# EAGLE design riffle-CT-mcv-0.1.0 (EAGLE 7.3.0)
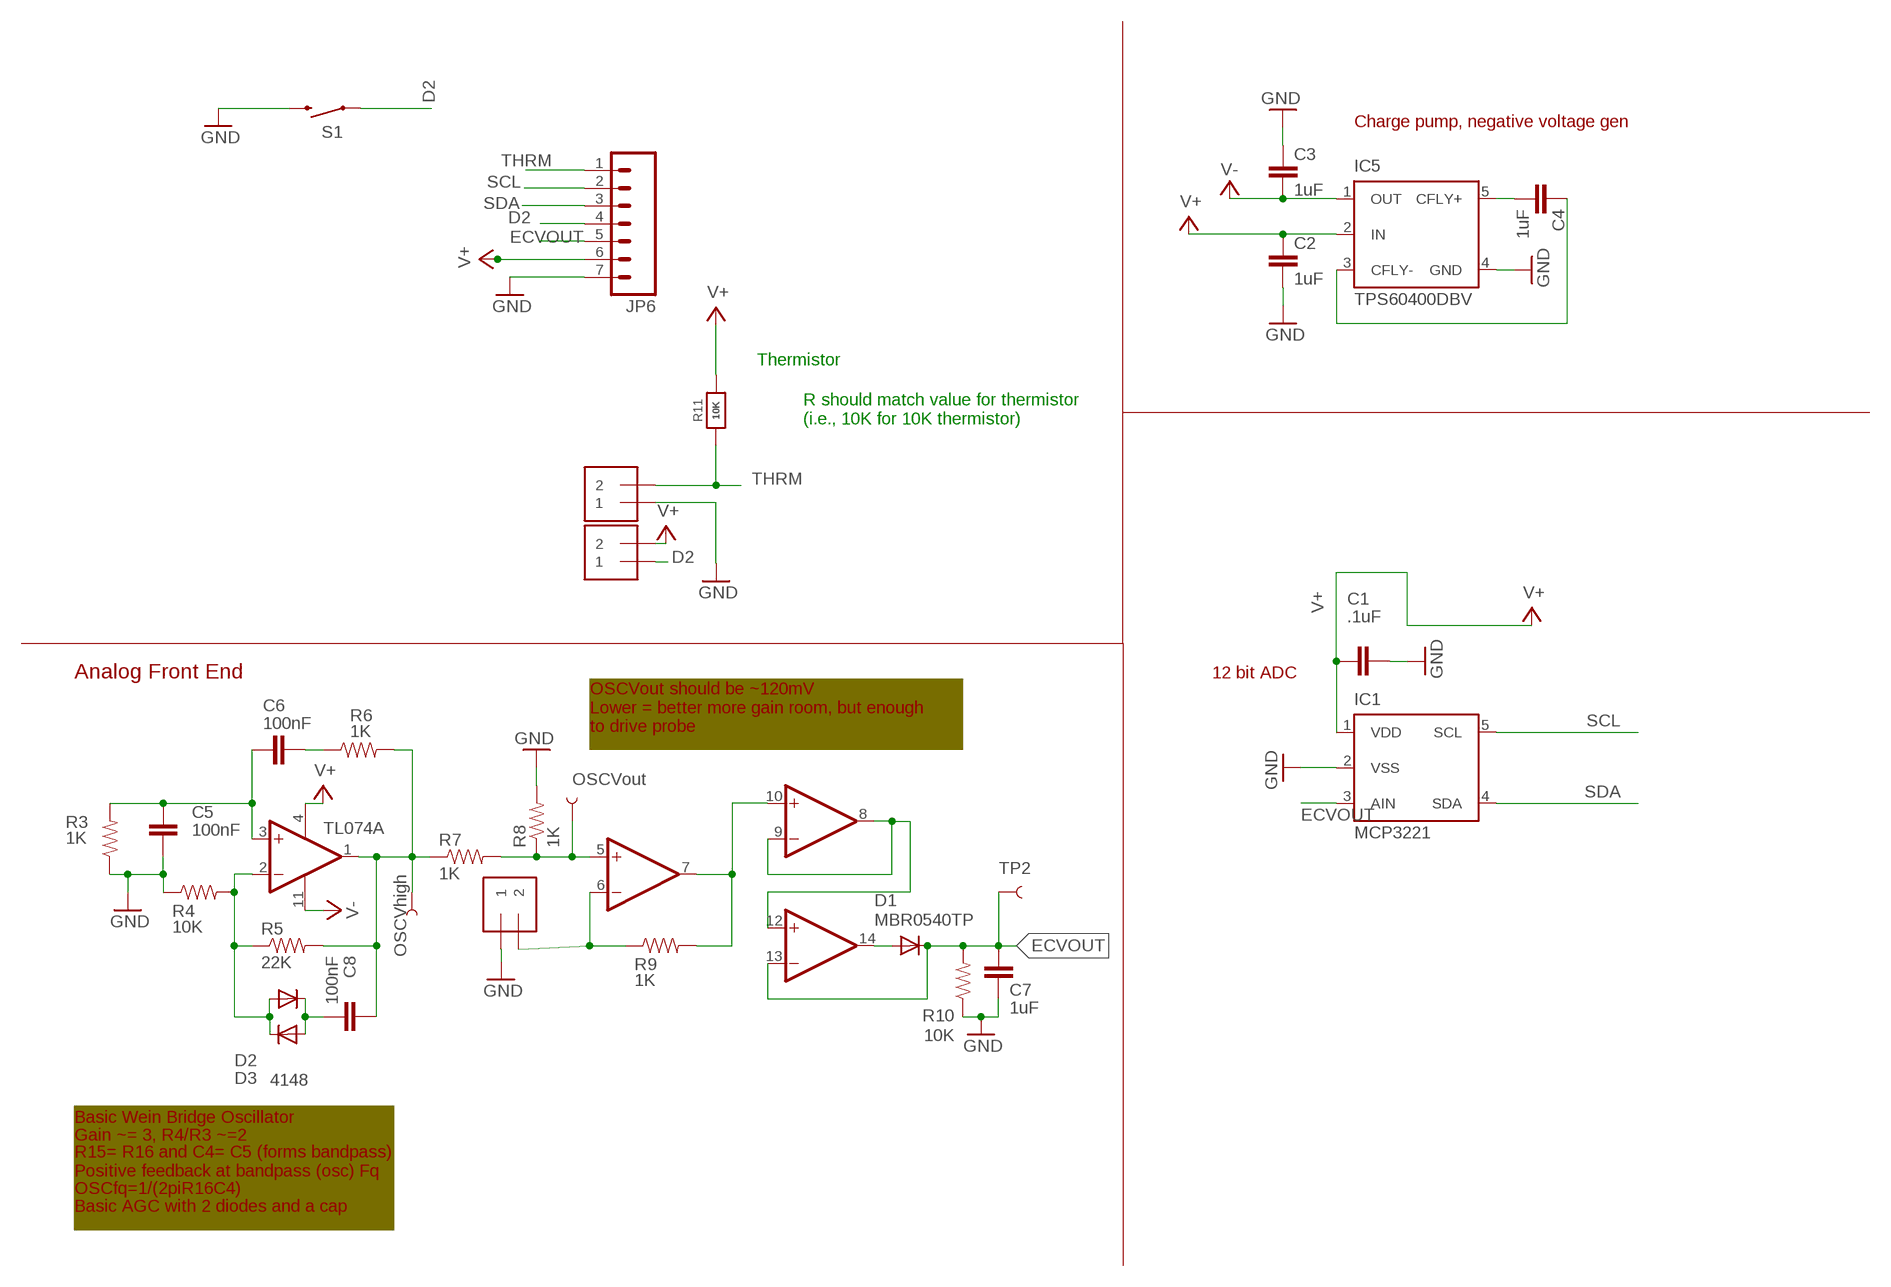
[diagram p0: schematic, sheet 1]

## Parts
1W  1X2-3.5MM  [1X2-3.5MM]
C1  .1uF  CAP0805  [0805]
C2  1uF  CAP0805  [0805]
C3  1uF  CAP0805  [0805]
C4  1uF  CAP0805  [0805]
C5  100nF  CAP0805  [0805]
C6  100nF  CAP0805  [0805]
C7  1uF  CAP0805  [0805]
C8  100nF  CAP0805  [0805]
D1  MBR0540TP  MBR0520LT  [SOD123]
D2  4148  MBR0520LT  [SOD123]
D3  4148  MBR0520LT  [SOD123]
EC  1X2-3.5MM  [1X2-3.5MM]
IC1  MCP3221  [SOT23-DBV]
IC5  TPS60400DBV  [SOT23-DBV]
JP6  M07  [1X07]
R3  1K  RESISTOR0805-RES  [0805]
R4  10K  RESISTOR0805-RES  [0805]
R5  22K  RESISTOR0805-RES  [0805]
R6  1K  RESISTOR0805-RES  [0805]
R7  1K  RESISTOR0805-RES  [0805]
R8  1K  RESISTOR0805-RES  [0805]
R9  1K  RESISTOR0805-RES  [0805]
R10  10K  RESISTOR0805-RES  [0805]
R11  10K  RESISTOR_0603_NOOUT  [0603-NO]
S1  REED  SWITCH-MOMENTARY-2PTH_REED2  [REED_SWITCH_PLASTIC]
THRM  1X2-3.5MM  [1X2-3.5MM]
TL074  TL074  QUADOPAMPM  [SO14]
TP2  TEST-POINT3  [PAD.03X.03]
TP3  OSCVhigh  TEST-POINT3  [PAD.03X.03]
TP5  OSCVout  TEST-POINT3  [PAD.03X.03]

## Nets
D2: 1W.1 JP6.4 S1.P$1
ECVOUT: C7.2 D1.C IC1.3(AIN) JP6.5 R10.2 TL074.13(D:-IN) TP2.P$1
GND: C1.1 C2.2 C3.1 C5.1 C7.1 EC.1 IC1.2(VSS) IC5.4(GND) JP6.7 R3.1 R4.1 R8.2 R10.1 S1.P$2 THRM.1
N$1: C8.2 D2.C D3.A
N$22: C4.1 IC5.3(CFLY-)
N$23: C4.2 IC5.5(CFLY+)
N$30: C5.2 C6.2 R3.2 TL074.3(A:+IN)
N$31: D2.A D3.C R4.2 R5.1 TL074.2(A:-IN)
N$32: C6.1 R6.1
N$33: C8.1 R5.2 R6.2 R7.1 TL074.1(A:OUT) TP3.P$1
N$34: R7.2 R8.1 TL074.5(B:+IN) TP5.P$1
N$35: EC.2 R9.1 TL074.6(B:-IN)
N$36: R9.2 TL074.7(B:OUT) TL074.10(C:+IN)
N$39: TL074.8(C:OUT) TL074.9(C:-IN) TL074.12(D:+IN)
N$41: D1.A TL074.14(D:OUT)
SCL: IC1.5(SCL) JP6.2
SDA: IC1.4(SDA) JP6.3
THRM: JP6.1 R11.1 THRM.2
V+: 1W.2 C1.2 C2.1 IC1.1(VDD) IC5.2(IN) JP6.6 R11.2 TL074.4(P:V+)
V-: C3.2 IC5.1(OUT) TL074.11(P:V-)

## Notes on the sheet
- Charge pump, negative voltage gen
- Thermistor
- R should match value for thermistor
  (i.e., 10K for 10K thermistor)
- Analog Front End | 12 bit ADC
- OSCVout should be ~120mV
  Lower = better more gain room, but enough
  to drive probe
- Basic Wein Bridge Oscillator
- Gain ~= 3, R4/R3 ~=2
- R15= R16 and C4= C5 (forms bandpass)
  Positive feedback at bandpass (osc) Fq
- OSCfq=1/(2piR16C4)
- Basic AGC with 2 diodes and a cap

## Library data of the parts
1W EC THRM = adafruit:1X2: 3.5mm Terminal block http://www.ladyada.net/library/pcb/eaglelibrary.html
C1-C8 = SparkysWidgets:CAP: Capacitor Standard 0603 ceramic capacitor, and 0.1" leaded capacitor.
D1-D3 = SparkysWidgets:MBR0520LT: SCHOTTKY BARRIER RECTIFIER Source: http://onsemi.com .. MBR0520LT1-D.pdf
IC1 = SparkysWidgets:MCP3221: 12 bit I2C ADC Low power 12-bit I2c ADC from MicroChip upto 22.3KSPS Source: http://ww1.microchip.com/downloads/en/DeviceDoc/21732b.pdf
IC5 = SparkysWidgets:TPS60400DBV: UNREGULATED CHARGE PUMP VOLTAGE INVERTER 60-mA unregultated charge pump voltage inverter Source: http://focus.ti.com/lit/ds/symlink/tps6040i.pdf
JP6 = SparkFun-Connectors:M07: Header 7 Standard 7-pin 0.1" header. Use with straight break away headers (SKU : PRT-00116), right angle break away headers (PRT-00553), swiss pins (PRT-00743), machine pins (PRT-00117), and female headers (PRT-00115). NOTES ON THE VARIANTS LOCK and LOCK_LONGPADS... This footprint was designed to help hold the alignment of a through-hole component (i.e. 7-pin header) while soldering it into place. You may notice that each hole has been shifted either up or down by 0.005 of an inch from it's more standard position (which is usually a perfectly straight line). This slight alteration caused the pins (the squares in the middle) to touch the edges of the holes. Because they are alternating, it causes a "brace" to hold the header in place. 0.005 has proven to be the perfect amount of "off-center" position when using our standard breakaway headers. Although looks a little odd when you look at the bare footprint, once you have a header in there, the alteration is very hard to notice. Also, if you push a header all the way into place, it is covered up entirely on the bottom side. This idea of altering the position of holes to aid alignment will be further integrated into the Sparkfun Library for other footprints. It can help hold any component with 3 or more connection pins.
R3-R10 = SparkysWidgets:RESISTOR: Resistor Basic schematic elements and footprints for 0603, 1206, and PTH resistors.
R11 = microbuilder:RESISTOR: Resistors For new designs, use the packages preceded by an '_' character since they are more reliable: The following footprints should be used on most boards: _0402 - Standard footprint for regular board layouts _0603 - Standard footprint for regular board layouts _0805 - Standard footprint for regular board layouts _1206 - Standard footprint for regular board layouts For extremely tight-pitch boards where space is at a premium, the following 'micro-pitch' footprints can be used (smaller pads, no silkscreen outline, etc.): _0402MP - Micro-pitch footprint for very dense/compact boards _0603MP - Micro-pitch footprint for very dense/compact boards _0805MP - Micro-pitch footprint for very dense/compact boards _1206MP - Micro-pitch footprint for very dense/compact boards
S1 = SparkFun-Electromechanical:SWITCH-MOMENTARY-2: Various NO switches- pushbuttons, reed, etc; PROD_ID: SWCH-10467
TL074 = SW_DigitalAnalogICs:QUADOPAMP: Quad General Purpose, Low Voltage, Rail-to-Rail Output Operational Amplifiers Source: http://www.national.com/mpf/LM/LMV321.html http://www.national.com/dt/lmv_qual.pdf
TP2 TP3 TP5 = SW_Passives:TEST-POINT: Bare copper test points for troubleshooting or ICT

## Board
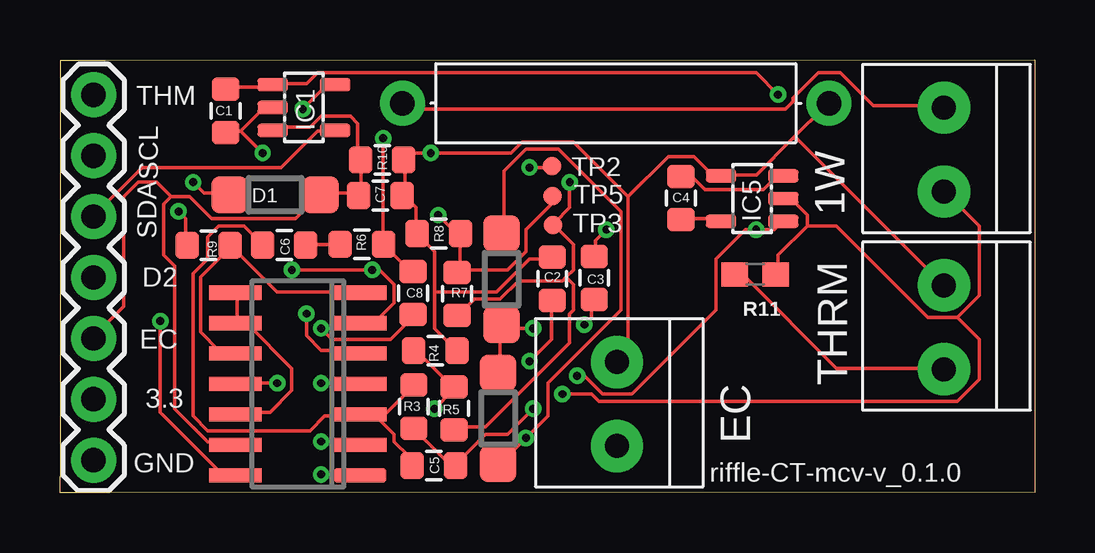
[diagram p1: board, top side]
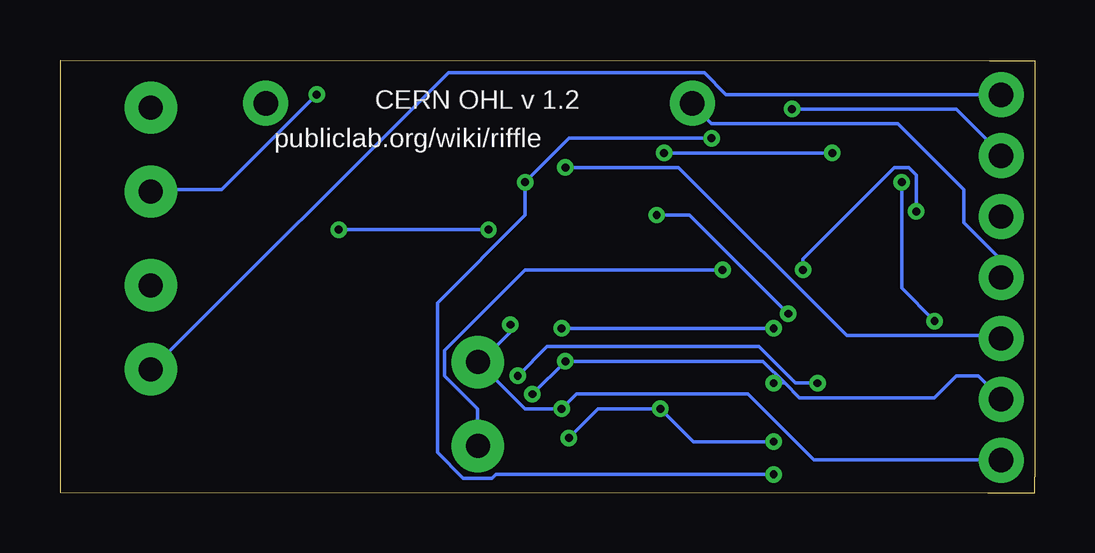
[diagram p2: board, bottom side, seen from below]

Size 40.64 x 18.05 mm. Coordinates in mm from the lower left corner, seen from the top.
Outline: 1.95,0 40.64,0.01 40.64,18.05 1.9,18.02
Outline: 0,18.01 0,0.65
Outline: 1.9,18.02 0,18.02 0,18
Outline: 1.95,0 0.01,0 0.01,0.67
Copper layers (1*16): Top 0.0356mm / dielectric 1.5011mm / Bottom 0.0356mm
Design rules "LaenPCBOrder": minimum track width 6mil, minimum drill 13mil, track to track 6mil, track to pad 6mil, pad to pad 6mil, via to via 6mil, smd to smd 6mil, copper to edge 15mil, drill to drill 6mil, minimum pad ring 7mil, minimum via ring 7mil, stop-mask expansion 4mil, vias tented up to drill 0mil, thermal gap 10mil

### Footprints (pad centres in the part's own frame; a part is rotated, then mirrored left to right if it is on the bottom)
1X2-3.5MM = drill 1 pad 2.184: 1 1.8,0; 2 -1.7,0
0805 = smd 0.984 x 1.143: 1 -0.9,0; 2 0.9,0
SOD123 = smd 1.524 x 1.524: A 1.9,0; C -1.9,0
SOT23-DBV = smd 0.55 x 1.27: 1 -0.95,-1.3; 2 0,-1.3; 3 0.95,-1.3; 4 0.95,1.3; 5 -0.95,1.3
1X07 = drill 1.016 pad 1.88: 1 0,0; 2 2.54,0; 3 5.08,0; 4 7.62,0; 5 10.16,0; 6 12.7,0; 7 15.24,0
0603-NO = smd 1.1 x 1: 1 -0.85,0; 2 0.85,0
REED_SWITCH_PLASTIC = drill 1.016 pad 1.88: P$1 -8.89,0; P$2 8.89,0
SO14 = smd 0.6 x 2.2: 1 -3.81,-2.6; 2 -2.54,-2.6; 3 -1.27,-2.6; 4 0,-2.6; 5 1.27,-2.6; 6 2.54,-2.6; 7 3.81,-2.6; 8 3.81,2.6; 9 2.54,2.6; 10 1.27,2.6; 11 0,2.6; 12 -1.27,2.6; 13 -2.54,2.6; 14 -3.81,2.6
PAD.03X.03 = smd 0.762 x 0.762: P$1 0,0

### Placement (x,y rotation side)
1W  36.85,14.25 90 top
C1  6.91,15.92 90 top
C2  20.52,8.92 90 top
C3  22.27,8.96 90 top
C4  25.88,12.29 270 top
C5  15.58,1.13 180 top
C6  9.35,10.33 180 top
C7  13.35,12.39 180 top
C8  14.72,8.32 270 top
D1  8.97,12.42 180 top
D2  18.26,3.1 270 top
D3  18.41,8.9 270 top
EC  23.22,3.64 90 top
IC1  10.17,16.06 270 top
IC5  28.85,12.27 90 top
JP6  1.4,16.59 270 top
R3  14.75,3.58 90 top
R4  15.65,5.92 180 top
R5  16.42,3.51 270 top
R6  12.58,10.35 0 top
R7  16.55,8.29 90 top
R8  15.79,10.8 180 top
R9  6.19,10.32 0 top
R10  13.43,13.88 180 top
R11  28.98,9.1 0 top
S1  23.17,16.24 0 top
THRM  36.85,6.84 90 top
TL074  9.91,4.53 90 top
TP2  20.51,13.61 0 top
TP3  20.55,11.16 0 top
TP5  20.53,12.37 0 top

### Tracks (layer width: path | path; a pad name or v marks a point on that pad's centre or on a via)
D2
  Top 0.152: 1W.1 36.79,16.15 33.9,16.15 32.53,17.52 31.61,17.52 30.55,16.45 30.55,16.3 30.24,16 14.54,16 14.39,16.15 S1.P$1
  Bottom 0.152: JP6.4 1.44,8.99 1.44,9.75 2.96,11.27 2.96,12.64 5.7,15.39 13.48,15.39 14.24,16.15 S1.P$1
ECVOUT  (via drill 0.33)
  Top 0.152: IC1.3 8.9,15.23 10.43,15.23 10.89,15.69 12.1,15.69 12.41,15.39 12.41,14.01 R10.2 12.56,13.86 12.56,12.49 C7.2 12.41,12.49 10.89,12.49 D1.C 10.73,12.34 9.82,11.42 6.31,11.42 5.4,12.34 4.64,12.34 | 4.64,12.34 4.33,12.03 4.33,9.9 4.79,9.44 4.79,3.5 6.16,2.13 7.23,2.13 TL074.13 | v19.57,13.56 20.49,13.56 TP2.P$1 | 4.64,12.34 4.03,12.95 3.27,12.95 2.66,12.34 2.66,7.77 1.44,6.55 JP6.5
  Bottom 0.152: v19.57,13.56 14.85,13.56 7.84,6.55 1.44,6.55 JP6.5
GND  (via drill 0.33)
  Top 0.152: 7.53,15.08 6.92,15.08 C1.1 | 7.53,15.08 8.45,16 8.75,16 IC1.2 | 15.61,8.38 15.61,10.05 15,10.66 R8.2 14.85,10.81 14.85,11.88 14.39,12.34 C7.1 14.39,12.49 14.39,13.86 R10.1 14.39,14.01 14.54,14.17 v15.46,14.17 18.81,14.17 19.27,14.62 21.4,14.62 23.69,12.34 | 15.61,8.38 15.61,6.85 16.52,5.94 R4.1 | 15.61,8.38 18.2,8.38 19.57,9.75 20.49,9.75 C2.2 | v8.45,14.17 7.53,15.08 | 30.55,14.78 31.92,16.15 S1.P$2 | 30.55,14.78 29.02,13.25 27.65,13.25 IC5.4 27.5,13.25 27.19,13.25 26.43,14.01 25.36,14.01 23.69,12.34 | 30.55,14.78 30.7,14.78 36.79,8.68 THRM.1 | R3.1 14.85,2.58 16.37,1.06 C5.1 16.52,1.21 17.74,2.43 18.66,2.43 v19.73,3.5 | v21.86,7 22.16,7.31 22.16,7.92 C3.1 | 23.69,12.34 23.69,5.94 23.23,5.48 EC.1
  Bottom 0.152: v15.46,14.17 v8.45,14.17 | v21.86,7 21.86,6.7 23.08,5.48 EC.1 23.08,5.33 21.25,3.5 v19.73,3.5 19.12,4.11 11.95,4.11 9.21,1.37 1.44,1.37 JP6.7
N$1  (via drill 0.33)
  Top 0.152: v10.89,6.85 11.34,6.39 13.78,6.39 14.7,7.31 C8.2 | v19.73,6.85 18.51,6.85 D3.A 18.35,6.85 18.35,5.02 D2.C
  Bottom 0.152: v19.73,6.85 v10.89,6.85
N$22
  Top 0.152: C4.1 25.97,13.1 26.43,13.1 26.89,12.64 29.33,12.64 29.78,13.1 30.09,13.1 IC5.3
N$23
  Top 0.152: C4.2 25.97,11.42 27.5,11.42 IC5.5
N$30
  Top 0.152: 13.32,3.04 13.17,3.19 12.56,3.19 TL074.3 | 13.32,3.04 13.93,2.43 13.93,2.13 14.54,1.52 14.54,1.21 C5.2 | C6.2 8.45,10.36 7.69,11.12 6.62,11.12 6.16,10.66 6.16,9.75 5.55,9.14 5.55,3.19 6.16,2.58 10.43,2.58 11.04,3.19 12.41,3.19 TL074.3 | 13.32,3.04 14.7,4.41 R3.2 | 13.32,3.04 TL074.3
N$31  (via drill 0.33)
  Top 0.152: R4.2 14.85,5.94 16.37,4.41 R5.1 16.37,4.26 v15.61,3.5 | v10.89,2.13 12.41,2.13 TL074.2 | D2.A 18.35,1.21 v19.42,2.28 20.33,3.19 20.33,4.57 23.38,7.61 23.38,11.73 20.79,14.32 19.42,14.32 18.51,13.4 18.51,10.81 D3.C
  Bottom 0.152: v10.89,2.13 14.24,2.13 v15.61,3.5 18.2,3.5 v19.42,2.28
N$32
  Top 0.152: C6.1 10.28,10.36 11.65,10.36 R6.1
N$33  (via drill 0.33)
  Top 0.152: C8.1 14.7,9.14 13.63,10.21 R6.2 v13.48,14.78 | 21.1,8.99 20.94,8.83 19.12,8.83 18.35,8.07 17.29,8.07 16.68,7.46 R7.1 | 21.1,8.99 21.4,9.29 21.4,10.36 20.64,11.12 TP3.P$1 20.64,11.27 21.25,11.88 v21.25,12.95 | 21.1,8.99 21.4,8.68 21.4,7.61 21.25,7.46 21.25,6.24 17.74,2.74 16.52,2.74 R5.2 | v10.89,0.76 12.41,0.76 TL074.1
  Bottom 0.152: v13.48,14.78 19.42,14.78 v21.25,12.95 21.25,11.58 24.91,7.92 24.91,1.67 23.84,0.6 22.62,0.6 22.47,0.76 v10.89,0.76
N$34  (via drill 0.33)
  Top 0.152: 16.68,9.29 18.66,9.29 19.42,10.05 19.42,10.97 20.49,12.03 20.49,12.34 TP5.P$1 | 16.68,9.29 16.68,10.66 | 16.68,9.29 R7.2 | v10.28,7.46 10.28,6.55 10.89,5.94 12.41,5.94 TL074.5 | 16.68,10.66 v15.76,11.58 | 16.68,10.66 R8.1
  Bottom 0.152: v10.28,7.46 14.39,11.58 v15.76,11.58
N$35  (via drill 0.33)
  Top 0.152: v4.94,11.73 5.25,11.42 5.25,10.36 R9.1 | v9.67,9.29 v13.02,9.29 13.32,9.29 13.93,8.68 13.93,7.92 13.17,7.16 12.56,7.16 TL074.6
  Bottom 0.152: v4.94,11.73 4.94,13.25 5.25,13.56 5.86,13.56 9.67,9.75 v9.67,9.29 | v13.02,9.29 21.25,9.29 24.6,5.94 24.6,4.87 23.23,3.5 23.23,1.97 EC.2
N$36
  Top 0.152: TL074.7 12.41,8.38 9.06,8.38 7.23,10.21 R9.2 7.08,10.21 5.86,8.99 5.86,6.7 6.62,5.94 7.23,5.94 TL074.10
N$39
  Top 0.152: TL074.12 7.38,3.35 8.75,3.35 9.67,4.26 9.67,5.18 7.84,7 7.38,7 TL074.9 7.38,7.16 7.38,8.22 TL074.8
N$41  (via drill 0.33)
  Top 0.152: v5.55,12.95 6.01,12.49 6.92,12.49 D1.A | v4.18,7.16 4.18,3.35 6.77,0.76 7.23,0.76 TL074.14
  Bottom 0.152: v5.55,12.95 5.55,8.53 v4.18,7.16
SCL  (via drill 0.33)
  Top 0.152: v10.12,16 11.04,16.91 11.34,16.91 IC1.5
  Bottom 0.152: v10.12,16 3.27,16 1.44,14.17 JP6.2
SDA
  Top 0.152: IC1.4 11.34,15.08 10.73,15.08 9.21,13.56 3.42,13.56 1.44,11.58 JP6.3
THRM
  Top 0.152: R11.1 28.26,8.99 28.56,8.99 32.37,5.18 36.79,5.18 THRM.2
  Bottom 0.152: JP6.1 1.44,16.61 12.87,16.61 13.78,17.52 24.45,17.52 36.79,5.18 THRM.2
V+  (via drill 0.33)
  Top 0.152: v19.57,5.48 20.49,6.39 20.49,7.92 C2.1 | v10.89,4.57 12.41,4.57 TL074.4 | 31.16,11.12 29.94,9.9 29.94,9.14 R11.2 | 31.16,11.12 31.16,11.58 30.55,12.19 30.24,12.19 IC5.2 | C1.2 6.92,16.91 8.75,16.91 IC1.1 8.9,17.06 10.28,17.06 10.73,17.52 29.02,17.52 v29.94,16.61 | 31.16,11.12 32.37,11.12 36.18,7.31 37.4,7.31 | 37.4,7.31 38.32,8.22 38.32,11.12 36.95,12.49 1W.2 | v20.94,4.11 22.16,4.11 22.47,3.8 37.4,3.8 38.32,4.72 38.32,6.39 37.4,7.31
  Bottom 0.152: 10.43,4.57 9.82,3.96 4.18,3.96 3.27,4.87 2.35,4.87 1.44,3.96 JP6.6 | 10.43,4.57 11.34,5.48 v19.57,5.48 v20.94,4.11 | 10.43,4.57 v10.89,4.57 | v29.94,16.61 33.9,12.64 36.79,12.64 1W.2
V-  (via drill 0.33)
  Top 0.152: v22.77,10.97 22.32,10.51 22.32,9.9 C3.2 | IC5.1 30.09,11.27 29.78,10.97 v29.02,10.97 28.56,10.97 27.35,9.75 27.35,7.61 23.84,4.11 22.62,4.11 21.86,4.87 v21.55,4.87 | v9.06,4.57 7.38,4.57 TL074.11
  Bottom 0.152: v29.02,10.97 v22.77,10.97 | v9.06,4.57 9.97,4.57 11.49,6.09 20.33,6.09 v21.55,4.87

### Text on the board
tPlace: THM | IC1 | SCL | TP2 | TP5 | SDA | TP3 | IC5 | D2 | EC | 3.3 | GND | riffle-CT-mcv-v_0.1.0
bPlace: CERN OHL v 1.2 | publiclab.org/wiki/riffle